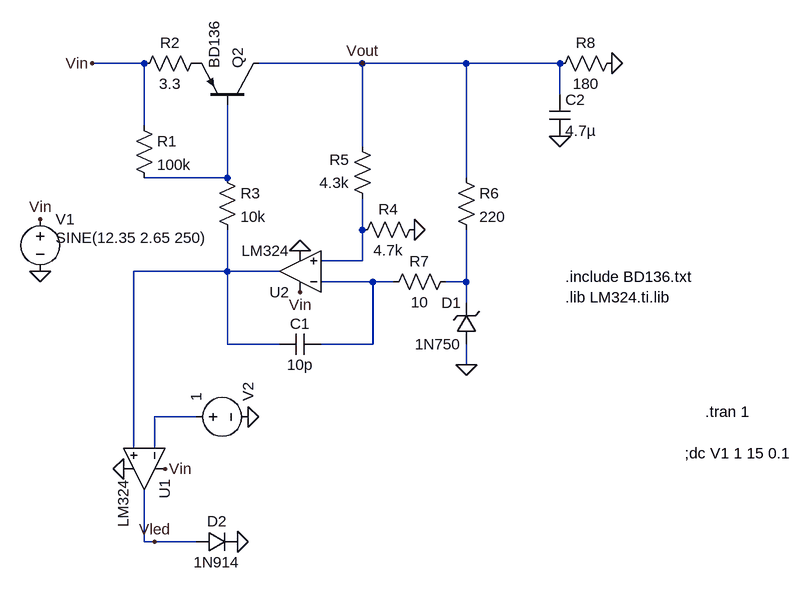
[diagram p0: schematic Lab2.asc]
Lab2.asc, the LTspice schematic file:
Version 4
SHEET 1 1688 864
WIRE 96 80 16 80
WIRE 432 80 272 80
WIRE 592 80 432 80
WIRE 736 80 592 80
WIRE 736 128 736 80
WIRE 96 176 96 80
WIRE 432 208 432 80
WIRE 224 256 224 144
WIRE 224 256 96 256
WIRE 592 256 592 80
WIRE 432 336 432 288
WIRE 432 384 432 336
WIRE 432 384 368 384
WIRE 224 400 224 336
WIRE 224 400 80 400
WIRE 304 400 224 400
WIRE 448 416 368 416
WIRE 480 416 448 416
WIRE 592 416 592 336
WIRE 592 416 560 416
WIRE 592 448 592 416
WIRE 224 512 224 400
WIRE 304 512 224 512
WIRE 448 512 448 416
WIRE 448 512 368 512
WIRE 592 544 592 512
WIRE 176 624 112 624
WIRE 80 672 80 400
WIRE 112 672 112 624
WIRE 96 816 96 736
WIRE 112 816 96 816
WIRE 176 816 112 816
FLAG 512 336 0
FLAG 592 544 0
FLAG 736 192 0
FLAG 336 368 0
FLAG -64 400 0
FLAG 336 432 Vin
FLAG -64 320 Vin
FLAG 16 80 Vin
FLAG 816 80 0
FLAG 432 80 Vout
FLAG 128 704 Vin
FLAG 64 704 0
FLAG 256 624 0
FLAG 240 816 0
FLAG 112 816 Vled
SYMBOL pnp 272 144 M270
SYMATTR InstName Q2
SYMATTR Value BD136
SYMBOL res 192 64 R90
WINDOW 0 0 56 VBottom 2
WINDOW 3 32 56 VTop 2
SYMATTR InstName R2
SYMATTR Value 3.3
SYMBOL res 80 160 R0
SYMATTR InstName R1
SYMATTR Value 100k
SYMBOL res 208 240 R0
SYMATTR InstName R3
SYMATTR Value 10k
SYMBOL OpAmps\\opamp2 336 464 R180
SYMATTR InstName U2
SYMATTR Value LM324
SYMBOL cap 368 496 R90
WINDOW 0 0 32 VBottom 2
WINDOW 3 32 32 VTop 2
SYMATTR InstName C1
SYMATTR Value 10p
SYMBOL res 448 304 R180
WINDOW 0 36 76 Left 2
WINDOW 3 36 40 Left 2
SYMATTR InstName R5
SYMATTR Value 4.3k
SYMBOL res 576 240 R0
SYMATTR InstName R6
SYMATTR Value 220
SYMBOL res 528 320 R90
WINDOW 0 0 56 VBottom 2
WINDOW 3 32 56 VTop 2
SYMATTR InstName R4
SYMATTR Value 4.7k
SYMBOL zener 608 512 R180
WINDOW 0 24 64 Left 2
WINDOW 3 24 0 Left 2
SYMATTR InstName D1
SYMATTR Value 1N750
SYMBOL res 576 400 R90
WINDOW 0 0 56 VBottom 2
WINDOW 3 32 56 VTop 2
SYMATTR InstName R7
SYMATTR Value 10
SYMBOL voltage -64 304 R0
WINDOW 3 24 44 Left 2
WINDOW 123 24 72 Left 2
WINDOW 39 0 0 Left 0
SYMATTR Value SINE(12.35 2.65 250)
SYMATTR InstName V1
SYMBOL cap 720 128 R0
SYMATTR InstName C2
SYMATTR Value 4.7µ
SYMBOL OpAmps\\opamp2 160 704 R90
SYMATTR InstName U1
SYMATTR Value LM324
SYMBOL res 832 64 R90
WINDOW 0 0 56 VBottom 2
WINDOW 3 32 56 VTop 2
SYMATTR InstName R8
SYMATTR Value 180
SYMBOL voltage 160 624 R270
WINDOW 0 24 96 Left 2
WINDOW 3 24 16 Left 2
WINDOW 123 0 0 Left 0
WINDOW 39 0 0 Left 0
SYMATTR InstName V2
SYMATTR Value 1
SYMBOL diode 176 832 R270
WINDOW 0 32 32 VTop 2
WINDOW 3 0 32 VBottom 2
SYMATTR InstName D2
SYMATTR Value 1N914
TEXT 744 408 Left 2 !.include BD136.txt
TEXT 744 440 Left 2 !.lib LM324.ti.lib
TEXT 960 616 Left 2 !.tran 1
TEXT 928 680 Left 2 !;dc V1 1 15 0.1

The netlist it stands for:
* Lab2.asc
Q2 Vout N001 P001 0 BD136
R2 P001 Vin 3.3
R1 Vin N001 100k
R3 N001 N003 10k
XU2 N002 N004 Vin 0 N003 LM324  ; pins In+ In- V+ V- OUT
C1 N004 N003 10p
R5 N002 Vout 4.3k
R6 Vout N005 220
R4 0 N002 4.7k
D1 0 N005 1N750
R7 N005 N004 10
V1 Vin 0 SINE(12.35 2.65 250)
C2 Vout 0 4.7µ
XU1 N003 N006 Vin 0 Vled LM324  ; pins In+ In- V+ V- OUT
R8 0 Vout 180
V2 N006 0 1
D2 Vled 0 1N914
.model D D
.lib standard.dio
.model NPN NPN
.model PNP PNP
.lib standard.bjt
.include BD136.txt
.lib LM324.ti.lib
.tran 1
;dc V1 1 15 0.1
.backanno
.end